# Altium schematic sheet ToF.SchDoc
size 420 x 297 mm
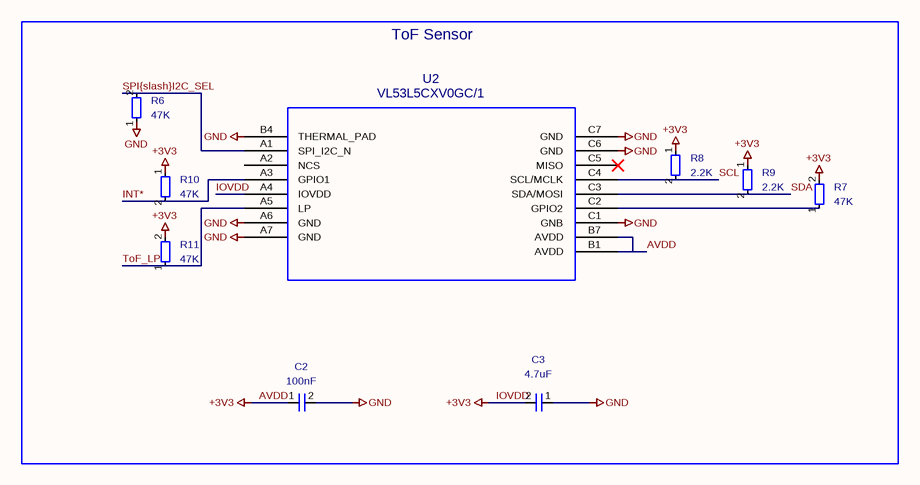
[diagram p0: ToF.SchDoc]

## Parts
C2  100nF  [C_0603_1608Metric]
C3  4.7uF  [C_0603_1608Metric]
R6  47K  [R_0603_1608Metric]
R7  47K  [R_0603_1608Metric]
R8  2.2K  [R_0603_1608Metric]
R9  2.2K  [R_0603_1608Metric]
R10  47K  [R_0603_1608Metric]
R11  47K  [R_0603_1608Metric]
U2  VL53L5CXV0GC/1  [LGA_CXV0GC&slash_1_STM]

## Blocks framed on the sheet
ToF Sensor: C2 C3 R6-R11 U2

## Nets
AVDD: C2.1 C3.2 R7.2 R8.1 R9.1 R10.1 R11.2 U2.A4(IOVDD) U2.B1(AVDD) U2.B7(AVDD)  [also labelled +3V3, IOVDD]
GND: C2.2 C3.1 R6.1 U2.A6(GND) U2.A7(GND) U2.B4(THERMAL_PAD) U2.C1(GNB) U2.C6(GND) U2.C7(GND)
INT*: R10.2 U2.A3(GPIO1)
SCL: R8.2 U2.C4(SCL/MCLK)
SDA: R9.2 U2.C3(SDA/MOSI)
SPI{slash}I2C_SEL: R6.2 U2.A1(SPI_I2C_N)
ToF_LP: R11.1 U2.A5(LP)
NetR7_1: R7.1 U2.C2(GPIO2)

Not connected (* = marked no-connect by the designer): U2 A2(NCS) C5(MISO)*

## Notes on the sheet
- 1
- 2
- 3
- 4
- 5
- 6
- 7
- 8
- A
- B
- C
- D
- E
- Title:
- File: ToF.kicad_sch
- Sheet: /
- F
- KiCad E.D.A.  kicad (5.1.4)-1
- Size: A3
- Date:
- Rev:
- Id: 1/1

## Library data of the parts
C2 C3 = C_Small: Description: Unpolarized capacitor, small symbol; Footprint: Capacitor_SMD:C_0603_1608Metric
  C2: Value: 100nF
  C3: Value: 4.7uF
R6-R11 = R_Small: Description: Resistor, small symbol; Footprint: Resistor_SMD:R_0603_1608Metric
  R6 R7 R10 R11: Value: 47K
  R8 R9: Value: 2.2K
U2 = VL53L5CXV0GC_1: Value: VL53L5CXV0GC/1; Footprint: LGA_CXV0GC/1_STM:LGA_CXV0GC&slash_1_STM